# EAGLE schematic ES_Daisy_Field_Rev4 (EAGLE 9.6.2)

## Sheet 1 of 5
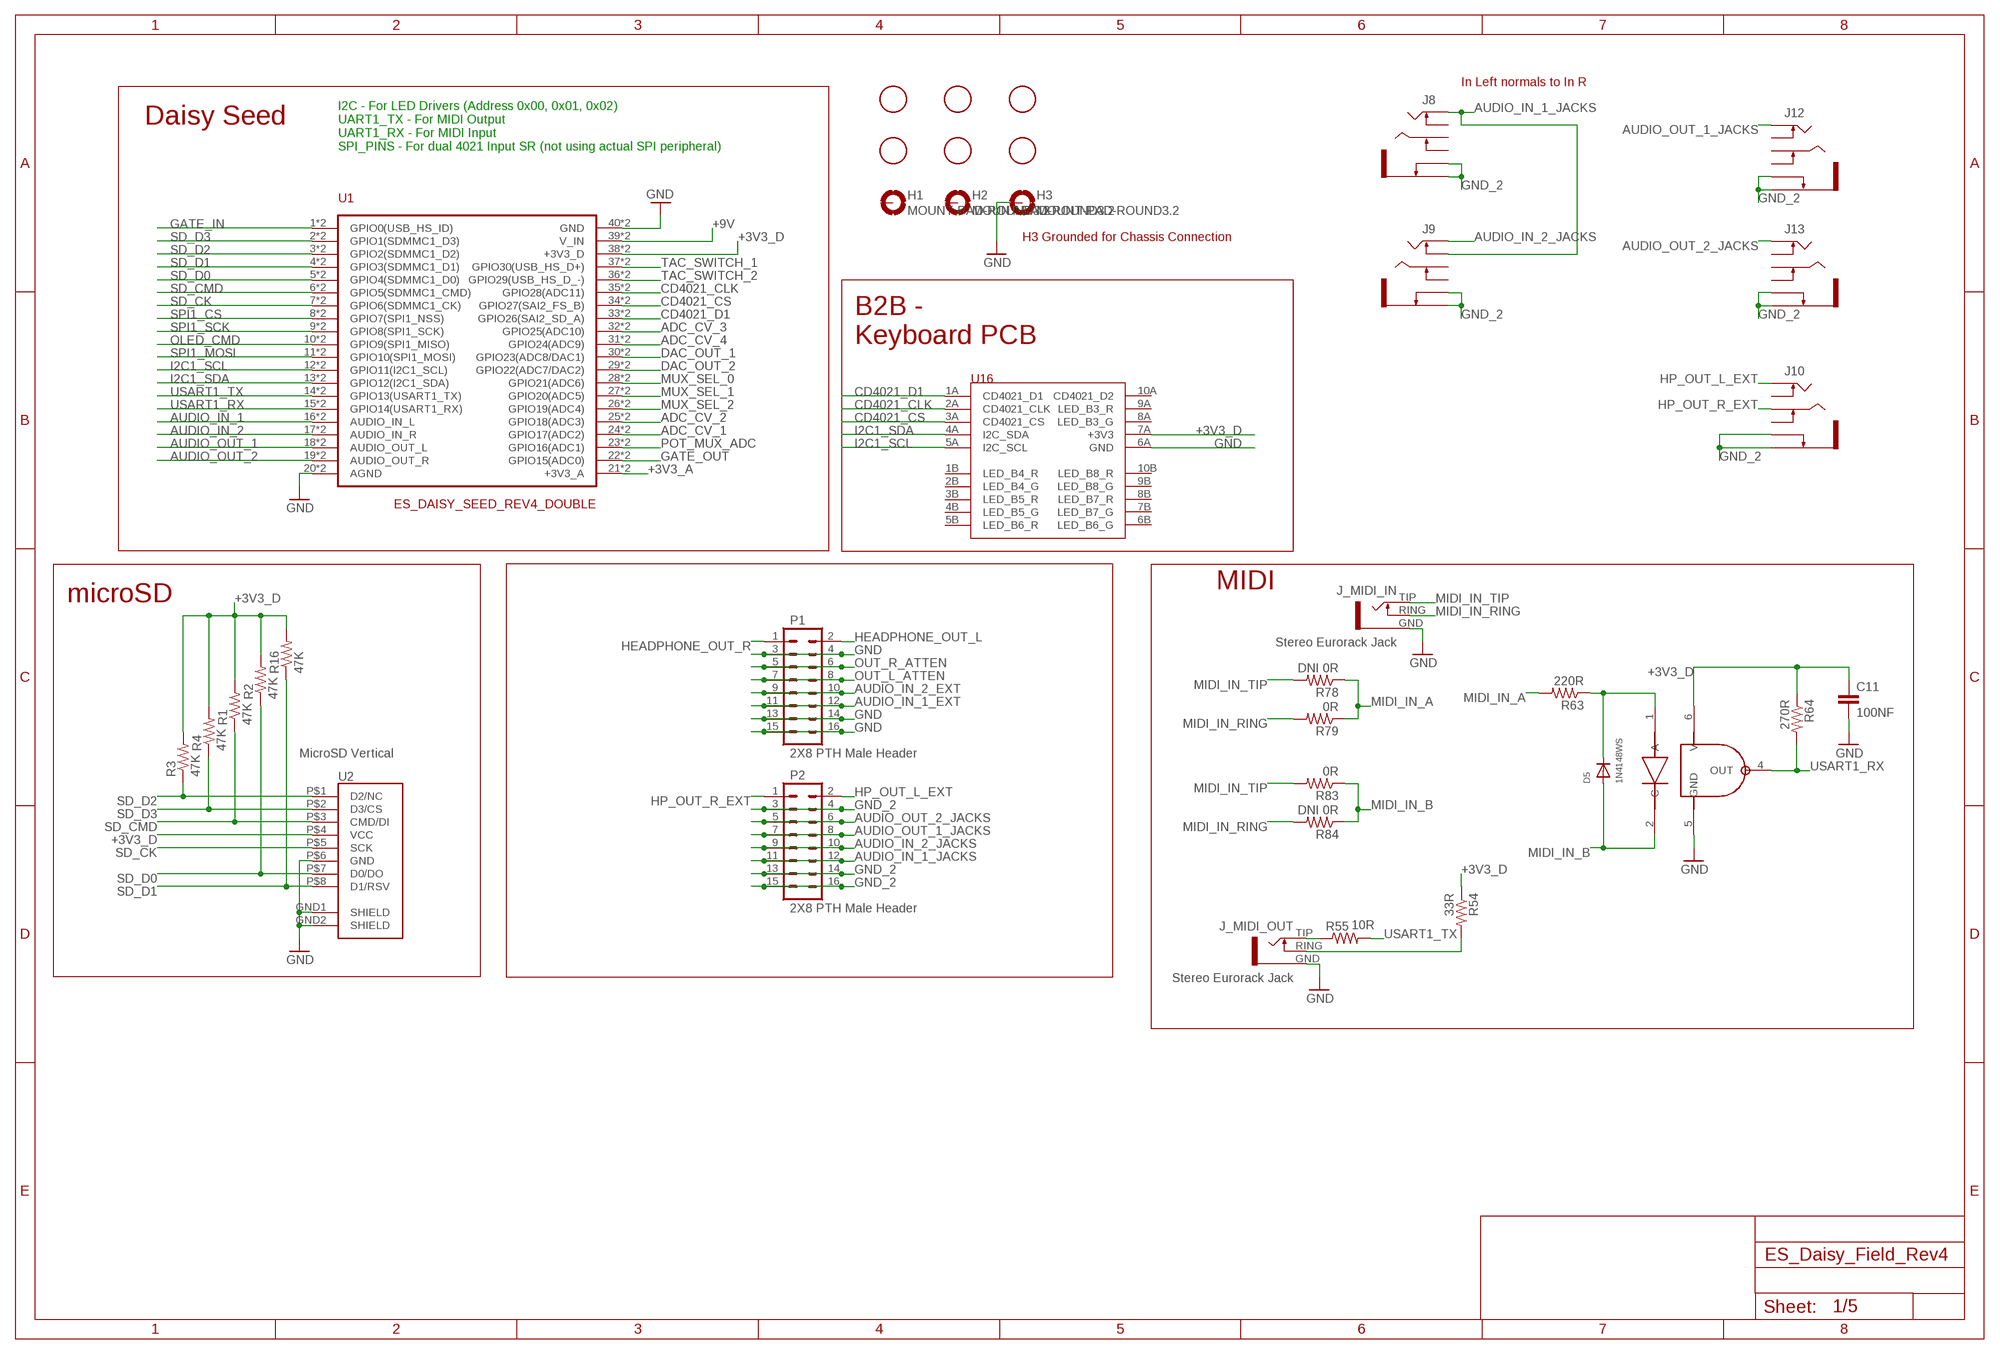
[diagram p0: schematic, sheet 1]

### Parts
C11  100NF  C-EUC0603  [C0603]
D5  1N4148WS  DIODE_SOD-323F  [SOD-323F]
FD1  FIDUCIAL  [FIDUCIAL_1MM]
FD2  FIDUCIAL  [FIDUCIAL_1MM]
FD3  FIDUCIAL  [FIDUCIAL_1MM]
FD4  FIDUCIAL  [FIDUCIAL_1MM]
FD5  FIDUCIAL  [FIDUCIAL_1MM]
FD6  FIDUCIAL  [FIDUCIAL_1MM]
H1  MOUNT-PAD-ROUND3.2  [32-PAD]
H2  MOUNT-PAD-ROUND3.2  [32-PAD]
H3  MOUNT-PAD-ROUND3.2  [32-PAD]
J8  PTH Switching Stereo Guitar Jack  JACK_TRS_SWITCHING_WQP-PJ6110  [WQP-PJ6110]
J9  PTH Switching Stereo Guitar Jack  JACK_TRS_SWITCHING_WQP-PJ6110  [WQP-PJ6110]
J10  PTH Switching Stereo Guitar Jack  JACK_TRS_SWITCHING_WQP-PJ6110  [WQP-PJ6110]
J12  PTH Switching Stereo Guitar Jack  JACK_TRS_SWITCHING_WQP-PJ6110  [WQP-PJ6110]
J13  PTH Switching Stereo Guitar Jack  JACK_TRS_SWITCHING_WQP-PJ6110  [WQP-PJ6110]
J_MIDI_IN  Stereo Eurorack Jack  STEREO_JACK  [STEREO_JACK_3.5MM]
J_MIDI_OUT  Stereo Eurorack Jack  STEREO_JACK  [STEREO_JACK_3.5MM]
P1  2X8 PTH Male Header  M08X2_LOCK_SILK  [2X8_LOCK]
P2  2X8 PTH Male Header  M08X2_LOCK_SILK  [2X8_LOCK]
R1  47K  R-US_R0603  [R0603]
R2  47K  R-US_R0603  [R0603]
R3  47K  R-US_R0603  [R0603]
R4  47K  R-US_R0603  [R0603]
R16  47K  R-US_R0603  [R0603]
R54  33R  R-US_R0603  [R0603]
R55  10R  R-US_R0603  [R0603]
R63  220R  R-US_R0603  [R0603]
R64  270R  R-US_R0603  [R0603]
R78  DNI 0R  R-US_R0603  [R0603]
R79  0R  R-US_R0603  [R0603]
R83  0R  R-US_R0603  [R0603]
R84  DNI 0R  R-US_R0603  [R0603]
U1  ES_DAISY_SEED_REV4_DOUBLE  [ES_DAISY_SEED_DOUBLE]
U2  MicroSD Vertical  MICRO_SD_CARDCENTERED  [VERT_MICROSD_CENTERED]
U15  OPTO ISOLATOR  OPTOISOLATOR_H11L1M  [DIL06_GULLWING]
U16  ES_KEYBOARD_SM_REV2_ALIGNED  [ES_KEYBOARD_SM_REV2_ALIGNED]

### Nets
+3V3_A: U1.21(+3V3_A) U1.B21(+3V3_A) ; also sheet 2
+3V3_D: C11.1 R1.2 R2.2 R3.2 R4.2 R16.2 R54.1 R64.1 U1.38(+3V3_D) U1.B38(+3V3_D) U2.P$4(VCC) U15.6(V) U16.7A(+3V3) ; also sheet 2,3
+9V: U1.39(V_IN) U1.B39(V_IN) ; also sheet 3,5
ADC_CV_1: U1.24(GPIO17(ADC2)) U1.B24(GPIO17(ADC2)) ; also sheet 2
ADC_CV_2: U1.25(GPIO18(ADC3)) U1.B25(GPIO18(ADC3)) ; also sheet 2
ADC_CV_3: U1.32(GPIO25(ADC10)) U1.B32(GPIO25(ADC10)) ; also sheet 2
ADC_CV_4: U1.31(GPIO24(ADC9)) U1.B31(GPIO24(ADC9)) ; also sheet 2
AUDIO_IN_1: U1.16(AUDIO_IN_L) U1.B16(AUDIO_IN_L) ; also sheet 4
AUDIO_IN_1_EXT: P1.11 P1.12 ; also sheet 4
AUDIO_IN_1_JACKS: J8.2(TIP) J9.5(TIP_SW) P2.11 P2.12
AUDIO_IN_2: U1.17(AUDIO_IN_R) U1.B17(AUDIO_IN_R) ; also sheet 4
AUDIO_IN_2_EXT: P1.9 P1.10 ; also sheet 4
AUDIO_IN_2_JACKS: J9.2(TIP) P2.9 P2.10
AUDIO_OUT_1: U1.18(AUDIO_OUT_L) U1.B18(AUDIO_OUT_L) ; also sheet 4
AUDIO_OUT_1_JACKS: J12.2(TIP) P2.7 P2.8
AUDIO_OUT_2: U1.19(AUDIO_OUT_R) U1.B19(AUDIO_OUT_R) ; also sheet 4
AUDIO_OUT_2_JACKS: J13.2(TIP) P2.5 P2.6
CD4021_CLK: U1.35(GPIO28(ADC11)) U1.B35(GPIO28(ADC11)) U16.2A(CD4021_CLK)
CD4021_CS: U1.34(GPIO27(SAI2_FS_B)) U1.B34(GPIO27(SAI2_FS_B)) U16.3A(CD4021_CS)
CD4021_D1: U1.33(GPIO26(SAI2_SD_A)) U1.B33(GPIO26(SAI2_SD_A)) U16.1A(CD4021_D1)
DAC_OUT_1: U1.30(GPIO23(ADC8/DAC1)) U1.B30(GPIO23(ADC8/DAC1)) ; also sheet 2
DAC_OUT_2: U1.29(GPIO22(ADC7/DAC2)) U1.B29(GPIO22(ADC7/DAC2)) ; also sheet 2
GATE_IN: U1.1(GPIO0(USB_HS_ID)) U1.B1(GPIO0(USB_HS_ID)) ; also sheet 2
GATE_OUT: U1.22(GPIO15(ADC0)) U1.B22(GPIO15(ADC0)) ; also sheet 2
GND: C11.2 H3.B3,2(MOUNT) J_MIDI_IN.GND J_MIDI_OUT.GND P1.3 P1.4 P1.13 P1.14 P1.15 P1.16 U1.20(AGND) U1.40(GND) U1.B20(AGND) U1.B40(GND) U2.GND1(SHIELD) U2.GND2(SHIELD) U2.P$6(GND) U15.5(GND) U16.6A(GND) ; also sheet 2,3,4,5
GND_2: J8.1(SLEEVE) J8.4(SLEEVE_SW) J9.1(SLEEVE) J9.4(SLEEVE_SW) J10.1(SLEEVE) J10.4(SLEEVE_SW) J12.1(SLEEVE) J12.4(SLEEVE_SW) J13.1(SLEEVE) J13.4(SLEEVE_SW) P2.3 P2.4 P2.13 P2.14 P2.15 P2.16
HEADPHONE_OUT_L [DATA]: P1.2 ; also sheet 4
HEADPHONE_OUT_R [DATA]: P1.1 ; also sheet 4
HP_OUT_L_EXT: J10.2(TIP) P2.2
HP_OUT_R_EXT: J10.3(RING) P2.1
I2C1_SCL: U1.12(GPIO11(I2C1_SCL)) U1.B12(GPIO11(I2C1_SCL)) U16.5A(I2C_SCL) ; also sheet 3
I2C1_SDA: U1.13(GPIO12(I2C1_SDA)) U1.B13(GPIO12(I2C1_SDA)) U16.4A(I2C_SDA) ; also sheet 3
MIDI_IN_A: R63.2 R78.1 R79.1
MIDI_IN_B: D5.A R83.1 R84.1 U15.2(C)
MIDI_IN_RING: J_MIDI_IN.RING(NORM) R79.2 R84.2
MIDI_IN_TIP: J_MIDI_IN.TIP R78.2 R83.2
MUX_SEL_0: U1.28(GPIO21(ADC6)) U1.B28(GPIO21(ADC6)) ; also sheet 2
MUX_SEL_1: U1.27(GPIO20(ADC5)) U1.B27(GPIO20(ADC5)) ; also sheet 2
MUX_SEL_2: U1.26(GPIO19(ADC4)) U1.B26(GPIO19(ADC4)) ; also sheet 2
N$51: J_MIDI_OUT.TIP R55.1
N$52: J_MIDI_OUT.RING(NORM) R54.2
N$77: D5.C R63.1 U15.1(A)
OLED_CMD: U1.10(GPIO9(SPI1_MISO)) U1.B10(GPIO9(SPI1_MISO)) ; also sheet 3
OUT_L_ATTEN: P1.7 P1.8 ; also sheet 4
OUT_R_ATTEN: P1.5 P1.6 ; also sheet 4
POT_MUX_ADC: U1.23(GPIO16(ADC1)) U1.B23(GPIO16(ADC1)) ; also sheet 2
SD_CK: U1.7(GPIO6(SDMMC1_CK)) U1.B7(GPIO6(SDMMC1_CK)) U2.P$5(SCK)
SD_CMD: R1.1 U1.6(GPIO5(SDMMC1_CMD)) U1.B6(GPIO5(SDMMC1_CMD)) U2.P$3(CMD/DI)
SD_D0: R2.1 U1.5(GPIO4(SDMMC1_D0)) U1.B5(GPIO4(SDMMC1_D0)) U2.P$7(D0/DO)
SD_D1: R16.1 U1.4(GPIO3(SDMMC1_D1)) U1.B4(GPIO3(SDMMC1_D1)) U2.P$8(D1/RSV)
SD_D2: R3.1 U1.3(GPIO2(SDMMC1_D2)) U1.B3(GPIO2(SDMMC1_D2)) U2.P$1(D2/NC)
SD_D3: R4.1 U1.2(GPIO1(SDMMC1_D3)) U1.B2(GPIO1(SDMMC1_D3)) U2.P$2(D3/CS)
SPI1_CS: U1.8(GPIO7(SPI1_NSS)) U1.B8(GPIO7(SPI1_NSS)) ; also sheet 3
SPI1_MOSI: U1.11(GPIO10(SPI1_MOSI)) U1.B11(GPIO10(SPI1_MOSI)) ; also sheet 3
SPI1_SCK: U1.9(GPIO8(SPI1_SCK)) U1.B9(GPIO8(SPI1_SCK)) ; also sheet 3
TAC_SWITCH_1: U1.37(GPIO30(USB_HS_D+)) U1.B37(GPIO30(USB_HS_D+)) ; also sheet 2
TAC_SWITCH_2: U1.36(GPIO29(USB_HS_D_-)) U1.B36(GPIO29(USB_HS_D_-)) ; also sheet 2
USART1_RX: R64.2 U1.15(GPIO14(USART1_RX)) U1.B15(GPIO14(USART1_RX)) U15.4(OUT)
USART1_TX: R55.2 U1.14(GPIO13(USART1_TX)) U1.B14(GPIO13(USART1_TX))
Unconnected: H1.B3,2(MOUNT) H2.B3,2(MOUNT) J8.3(RING) J8.5(TIP_SW) J8.6(RING_SW) J9.3(RING) J9.6(RING_SW) J10.5(TIP_SW) J10.6(RING_SW) J12.3(RING) J12.5(TIP_SW) J12.6(RING_SW) J13.3(RING) J13.5(TIP_SW) J13.6(RING_SW) U16.1B(LED_B4_R) U16.2B(LED_B4_G) U16.3B(LED_B5_R) U16.4B(LED_B5_G) U16.5B(LED_B6_R) U16.6B(LED_B6_G) U16.7B(LED_B7_G) U16.8A(LED_B3_G) U16.8B(LED_B7_R) U16.9A(LED_B3_R) U16.9B(LED_B8_G) U16.10A(CD4021_D2) U16.10B(LED_B8_R)

### Notes on the sheet
- In Left normals to In R
- Daisy Seed
- I2C - For LED Drivers (Address 0x00, 0x01, 0x02)
  UART1_TX - For MIDI Output
  UART1_RX - For MIDI Input
  SPI_PINS - For dual 4021 Input SR (not using actual SPI peripheral)
- H3 Grounded for Chassis Connection
- B2B - 
  Keyboard PCB
- MIDI
- microSD

## Sheet 2 of 5
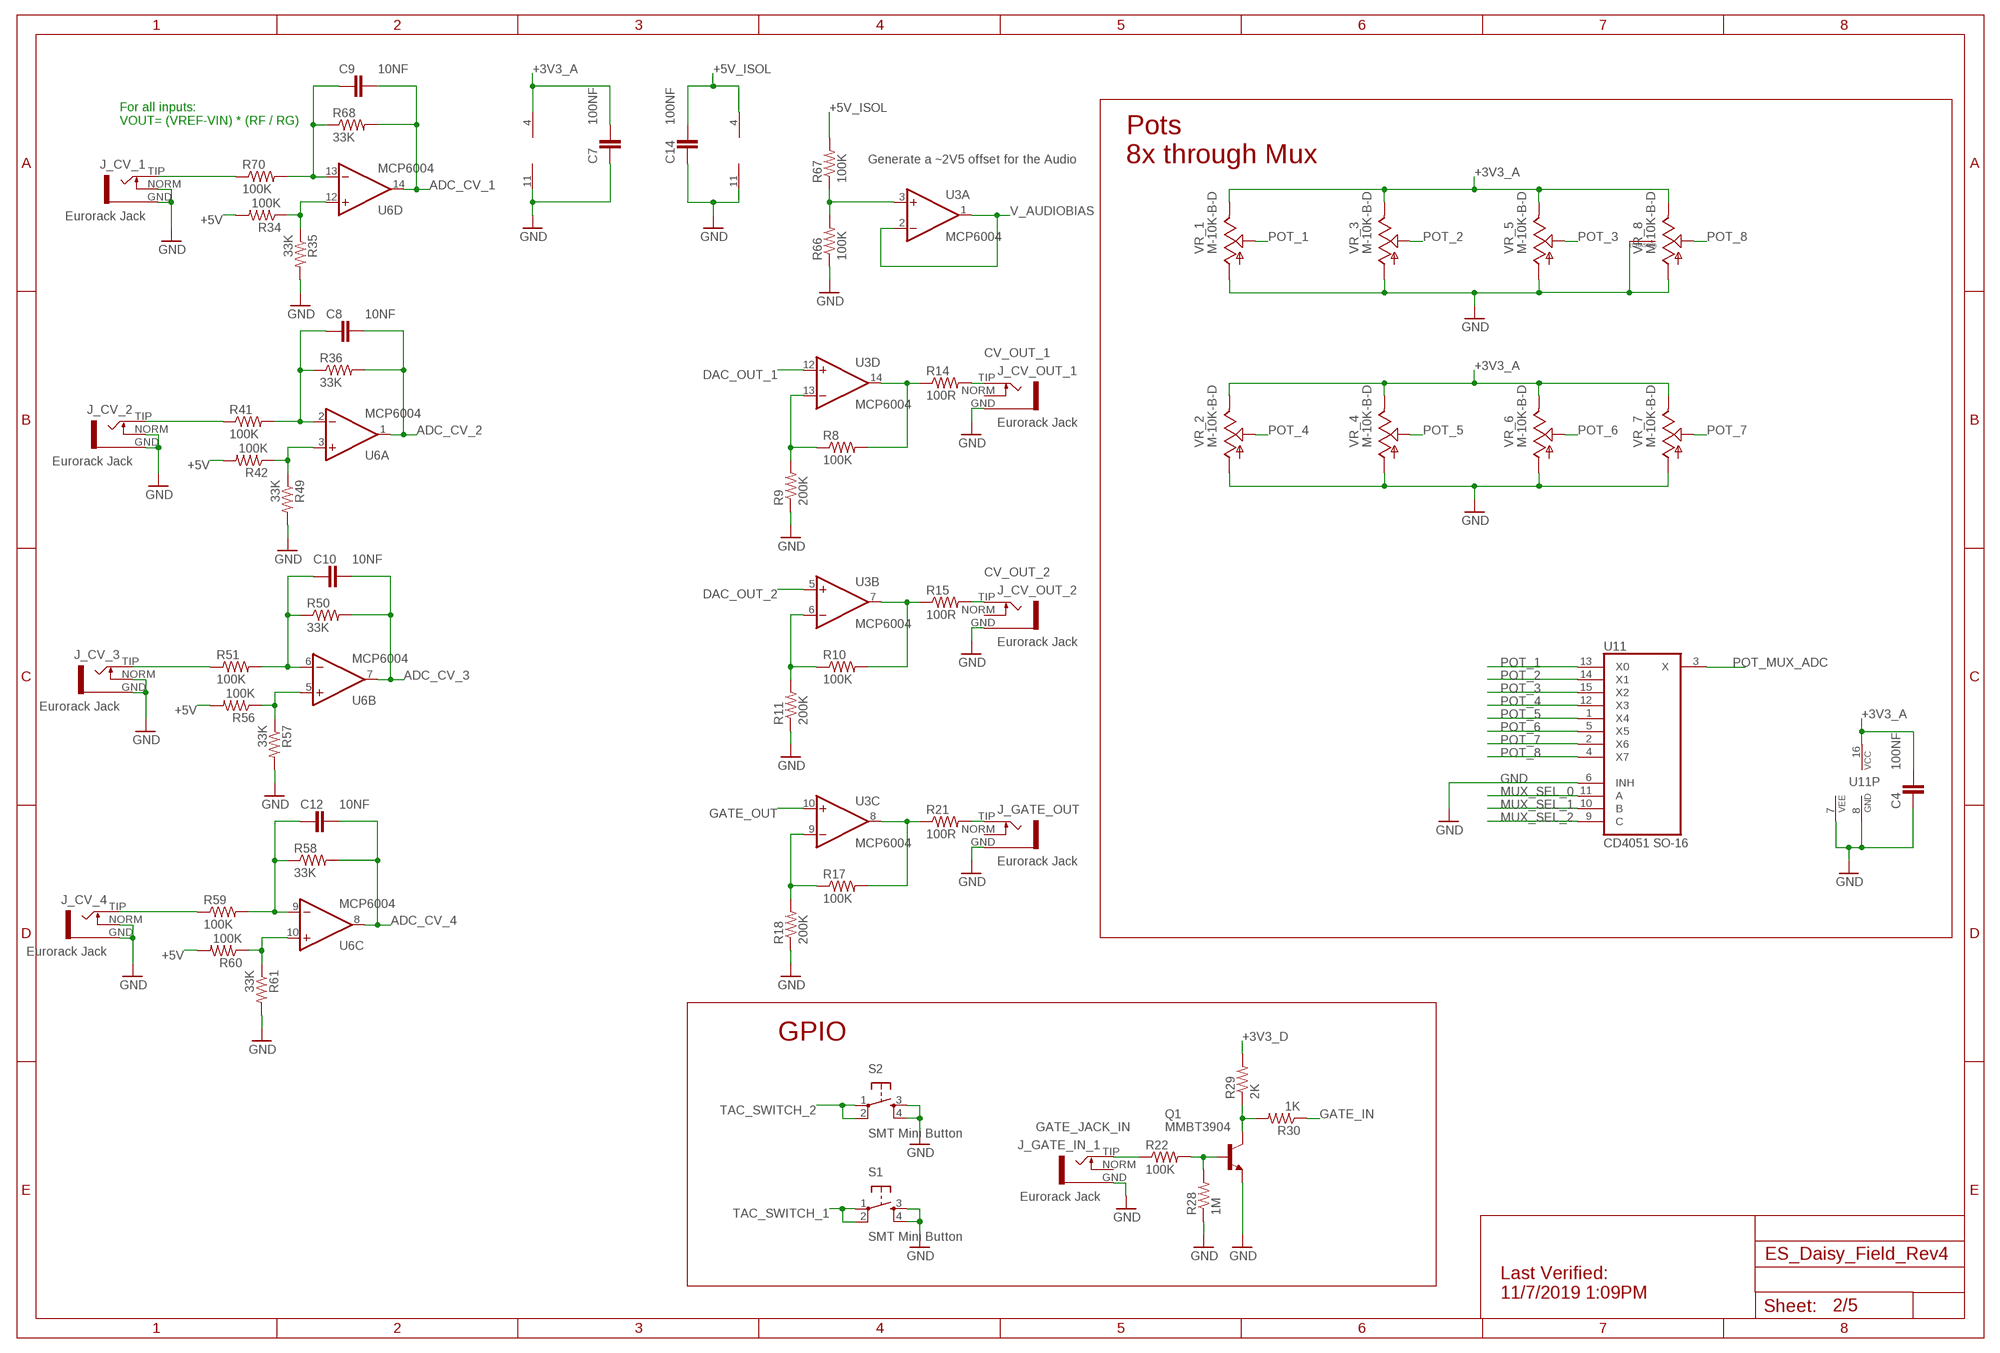
[diagram p1: schematic, sheet 2]

### Parts
C4  100NF  C-EUC0603  [C0603]
C7  100NF  C-EUC0603  [C0603]
C8  10NF  C-EUC0603  [C0603]
C9  10NF  C-EUC0603  [C0603]
C10  10NF  C-EUC0603  [C0603]
C12  10NF  C-EUC0603  [C0603]
C14  100NF  C-EUC0603  [C0603]
J_CV_1  Eurorack Jack  EURO_JACK  [S_JACK]
J_CV_2  Eurorack Jack  EURO_JACK  [S_JACK]
J_CV_3  Eurorack Jack  EURO_JACK  [S_JACK]
J_CV_4  Eurorack Jack  EURO_JACK  [S_JACK]
J_CV_OUT_1  Eurorack Jack  EURO_JACK  [S_JACK]
J_CV_OUT_2  Eurorack Jack  EURO_JACK  [S_JACK]
J_GATE_IN_1  Eurorack Jack  EURO_JACK  [S_JACK]
J_GATE_OUT  Eurorack Jack  EURO_JACK  [S_JACK]
Q1  MMBT3904  NPNSOT23-BEC  [SOT23-BEC]
R8  100K  R-US_R0603  [R0603]
R9  200K  R-US_R0603  [R0603]
R10  100K  R-US_R0603  [R0603]
R11  200K  R-US_R0603  [R0603]
R14  100R  R-US_R0603  [R0603]
R15  100R  R-US_R0603  [R0603]
R17  100K  R-US_R0603  [R0603]
R18  200K  R-US_R0603  [R0603]
R21  100R  R-US_R0603  [R0603]
R22  100K  R-US_R0603  [R0603]
R28  1M  R-US_R0603  [R0603]
R29  2K  R-US_R0603  [R0603]
R30  1K  R-US_R0603  [R0603]
R34  100K  R-US_R0603  [R0603]
R35  33K  R-US_R0603  [R0603]
R36  33K  R-US_R0603  [R0603]
R41  100K  R-US_R0603  [R0603]
R42  100K  R-US_R0603  [R0603]
R49  33K  R-US_R0603  [R0603]
R50  33K  R-US_R0603  [R0603]
R51  100K  R-US_R0603  [R0603]
R56  100K  R-US_R0603  [R0603]
R57  33K  R-US_R0603  [R0603]
R58  33K  R-US_R0603  [R0603]
R59  100K  R-US_R0603  [R0603]
R60  100K  R-US_R0603  [R0603]
R61  33K  R-US_R0603  [R0603]
R66  100K  R-US_R0603  [R0603]
R67  100K  R-US_R0603  [R0603]
R68  33K  R-US_R0603  [R0603]
R70  100K  R-US_R0603  [R0603]
S1  SMT Mini Button  TAC_SWITCH_SMT  [TL3301SPF160QJ]
S2  SMT Mini Button  TAC_SWITCH_SMT  [TL3301SPF160QJ]
U3  MCP6004  MCP6004_TSSOP-14  [TSSOP-14]
U6  MCP6004  MCP6004_TSSOP-14  [TSSOP-14]
U11  CD4051 SO-16  4051D  [SO-16]
VR_1  M-10K-B-D  POT_9MM_SNAP-IN__  [9MM_SNAP-IN_POT_SILK]
VR_2  M-10K-B-D  POT_9MM_SNAP-IN__  [9MM_SNAP-IN_POT_SILK]
VR_3  M-10K-B-D  POT_9MM_SNAP-IN__  [9MM_SNAP-IN_POT_SILK]
VR_4  M-10K-B-D  POT_9MM_SNAP-IN__  [9MM_SNAP-IN_POT_SILK]
VR_5  M-10K-B-D  POT_9MM_SNAP-IN__  [9MM_SNAP-IN_POT_SILK]
VR_6  M-10K-B-D  POT_9MM_SNAP-IN__  [9MM_SNAP-IN_POT_SILK]
VR_7  M-10K-B-D  POT_9MM_SNAP-IN__  [9MM_SNAP-IN_POT_SILK]
VR_8  M-10K-B-D  POT_9MM_CHASSIS_  [9MM_SNAP-IN_POT_SILK]

### Nets
+3V3_A: C4.2 C7.2 U6.4(P:V+) U11.16(VCC) VR_1.3 VR_2.3 VR_3.3 VR_4.3 VR_5.3 VR_6.3 VR_7.3 VR_8.3(E) ; also sheet 1
+3V3_D: R29.2 ; also sheet 1,3
+5V: R34.2 R42.2 R56.2 R60.2 ; also sheet 5
+5V_ISOL: C14.2 R67.2 U3.4(P:V+) ; also sheet 4,5
ADC_CV_1: C9.2 R68.2 U6.14(D:OUT) ; also sheet 1
ADC_CV_2: C8.2 R36.2 U6.1(A:OUT) ; also sheet 1
ADC_CV_3: C10.2 R50.2 U6.7(B:OUT) ; also sheet 1
ADC_CV_4: C12.2 R58.2 U6.8(C:OUT) ; also sheet 1
CV_OUT_1: J_CV_OUT_1.TIP R14.2
CV_OUT_2: J_CV_OUT_2.TIP R15.2
CV_OUT_3: J_GATE_OUT.TIP R21.2
DAC_OUT_1: U3.12(D:+IN) ; also sheet 1
DAC_OUT_2: U3.5(B:+IN) ; also sheet 1
GATE_IN: R30.1 ; also sheet 1
GATE_JACK_IN: J_GATE_IN_1.TIP R22.1
GATE_OUT: U3.10(C:+IN) ; also sheet 1
GND: C4.1 C7.1 C14.1 J_CV_1.GND J_CV_1.NORM J_CV_2.GND J_CV_2.NORM J_CV_3.GND J_CV_3.NORM J_CV_4.GND J_CV_4.NORM J_CV_OUT_1.GND J_CV_OUT_2.GND J_GATE_IN_1.GND J_GATE_OUT.GND Q1.E R9.1 R11.1 R18.1 R28.1 R35.2 R49.2 R57.2 R61.2 R66.1 S1.3 S1.4 S2.3 S2.4 U3.11(P:V-) U6.11(P:V-) U11.6(INH) U11.7(VEE) U11.8(GND) VR_1.1 VR_2.1 VR_3.1 VR_4.1 VR_5.1 VR_6.1 VR_7.1 VR_8.1(A) VR_8.CHASSIS1(CHASSIS) VR_8.CHASSIS2(CHASSIS) ; also sheet 1,3,4,5
MUX_SEL_0: U11.11(A) ; also sheet 1
MUX_SEL_1: U11.10(B) ; also sheet 1
MUX_SEL_2: U11.9(C) ; also sheet 1
N$3: R10.2 R15.1 U3.7(B:OUT)
N$4: R8.2 R14.1 U3.14(D:OUT)
N$5: R8.1 R9.2 U3.13(D:-IN)
N$6: R34.1 R35.1 U6.12(D:+IN)
N$7: R10.1 R11.2 U3.6(B:-IN)
N$8: C8.1 R36.1 R41.2 U6.2(A:-IN)
N$9: Q1.C R29.1 R30.2
N$10: J_CV_2.TIP R41.1
N$11: R42.1 R49.1 U6.3(A:+IN)
N$13: R17.2 R21.1 U3.8(C:OUT)
N$14: R17.1 R18.2 U3.9(C:-IN)
N$21: C10.1 R50.1 R51.2 U6.6(B:-IN)
N$22: J_CV_3.TIP R51.1
N$25: R56.1 R57.1 U6.5(B:+IN)
N$26: C12.1 R58.1 R59.2 U6.9(C:-IN)
N$27: J_CV_4.TIP R59.1
N$28: R60.1 R61.1 U6.10(C:+IN)
N$32: Q1.B R22.2 R28.2
N$42: R66.2 R67.1 U3.3(A:+IN)
N$108: C9.1 R68.1 R70.2 U6.13(D:-IN)
N$110: J_CV_1.TIP R70.1
POT_1: U11.13(X0) VR_1.2
POT_2: U11.14(X1) VR_3.2
POT_3: U11.15(X2) VR_5.2
POT_4: U11.12(X3) VR_2.2
POT_5: U11.1(X4) VR_4.2
POT_6: U11.5(X5) VR_6.2
POT_7: U11.2(X6) VR_7.2
POT_8: U11.4(X7) VR_8.2(S)
POT_MUX_ADC: U11.3(X) ; also sheet 1
TAC_SWITCH_1: S1.1 S1.2 ; also sheet 1
TAC_SWITCH_2: S2.1 S2.2 ; also sheet 1
V_AUDIOBIAS: U3.1(A:OUT) U3.2(A:-IN) ; also sheet 4
Unconnected: J_CV_OUT_1.NORM J_CV_OUT_2.NORM J_GATE_IN_1.NORM J_GATE_OUT.NORM

### Notes on the sheet
- For all inputs:
  VOUT= (VREF-VIN) * (RF / RG)
- Generate a ~2V5 offset for the Audio
- Pots
  8x through Mux
- GPIO
- Last Verified:
  11/7/2019 1:09PM

## Sheet 3 of 5
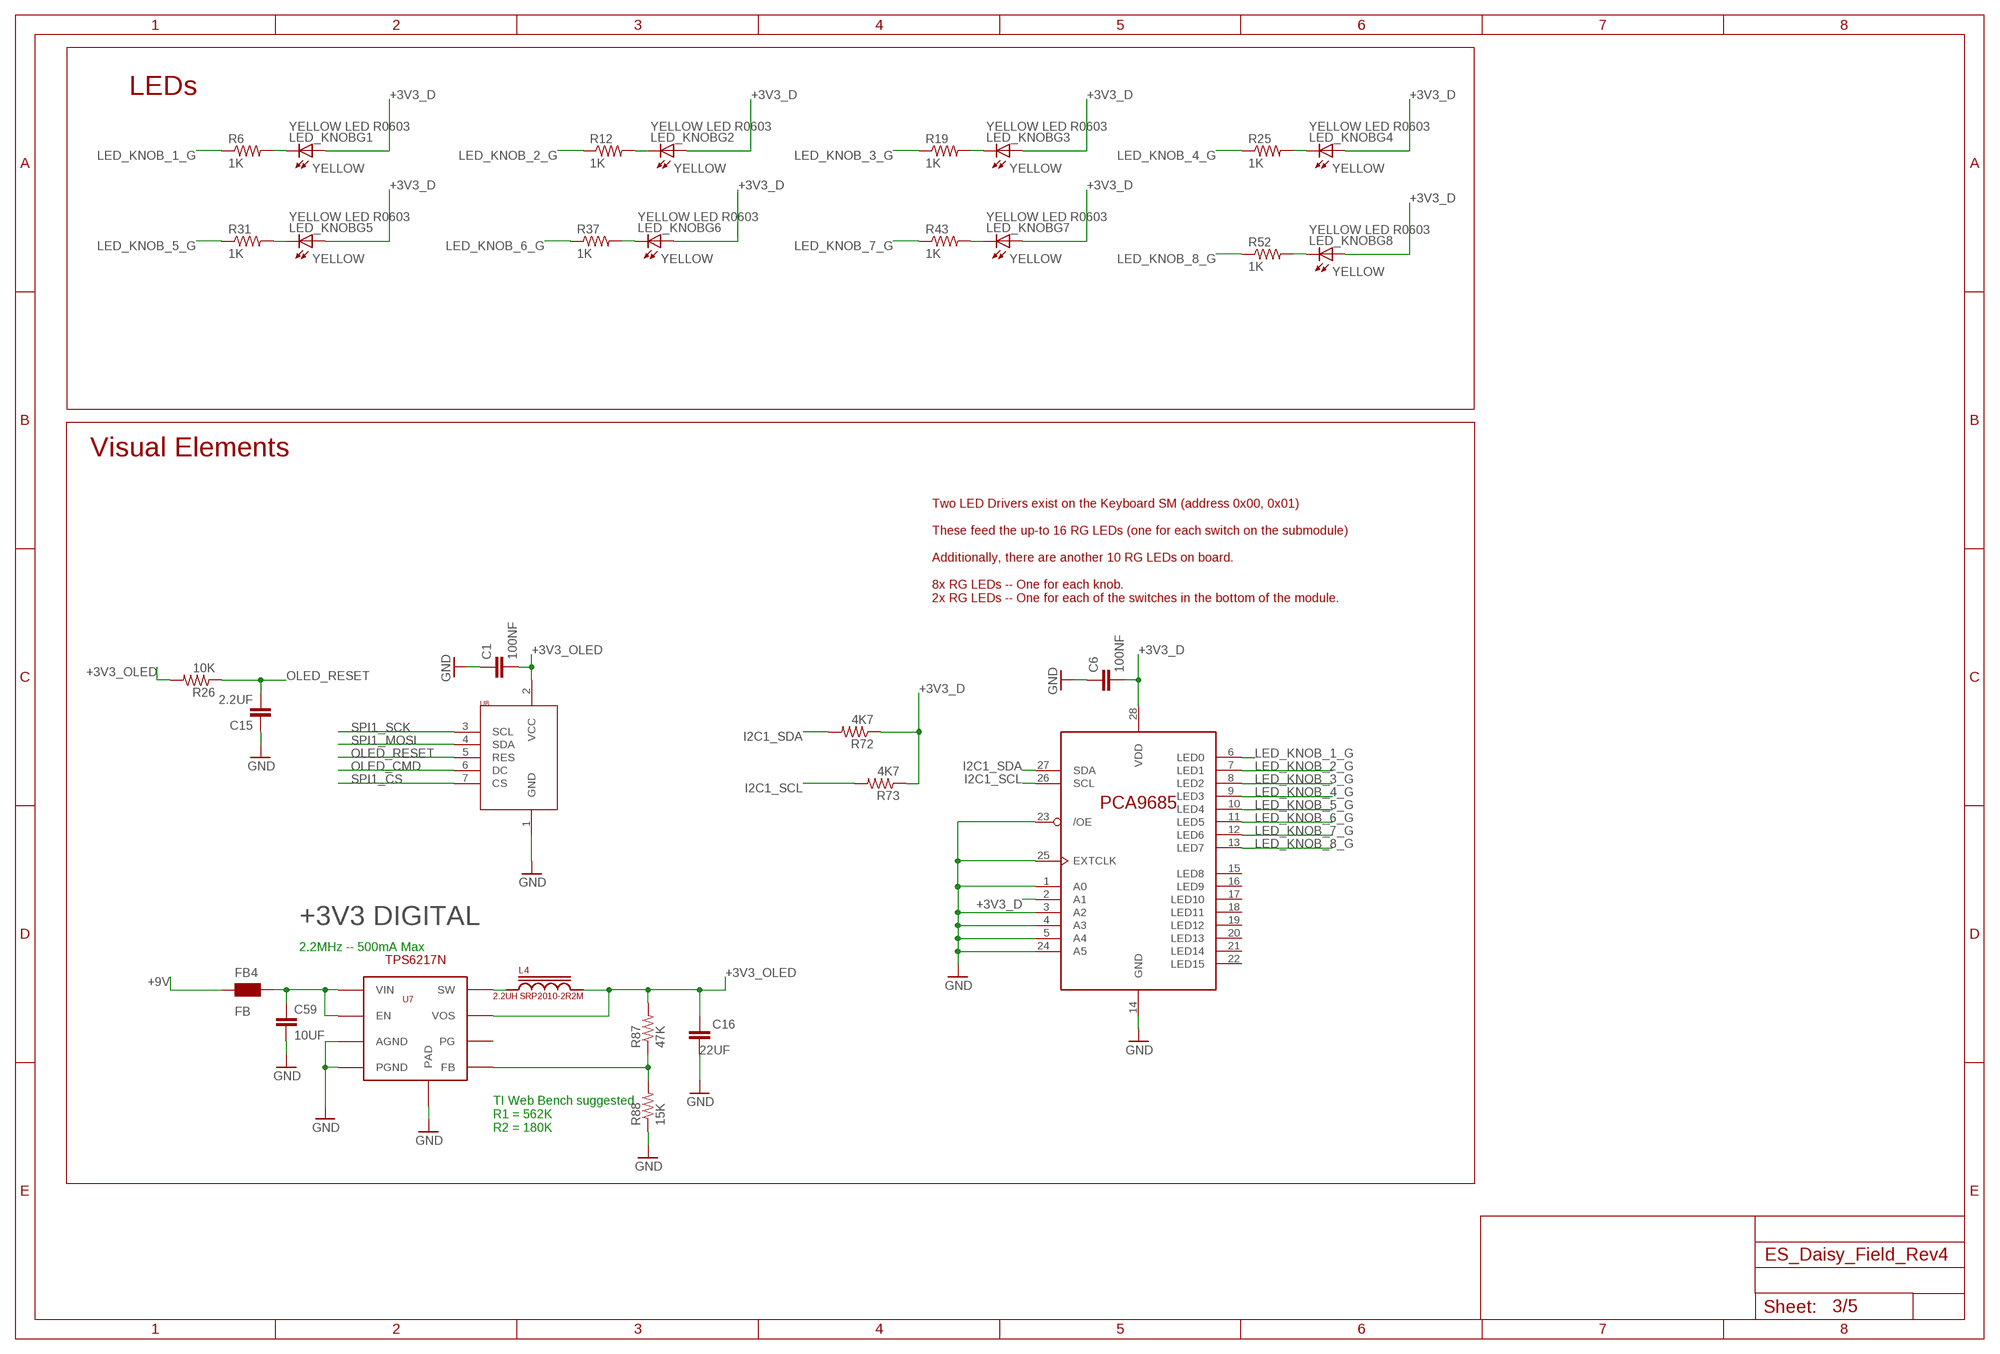
[diagram p2: schematic, sheet 3]

### Parts
C1  100NF  C-EUC0603  [C0603]
C6  100NF  C-EUC0603  [C0603]
C15  2.2UF  C-EUC0603  [C0603]
C16  22UF  C-EUC1206  [C1206]
C59  10UF  C-EUC0805  [C0805]
FB4  FB  FERRITE_BEAD_0603  [WUERTH-ELEKTRONIK_0603]
L4  2.2UH SRP2010-2R2M  INDUCTORS  [BOURNS_SRP2010]
LED_KNOBG1  YELLOW LED R0603  LED_YELLOW_0603  [DIODE_0603]
LED_KNOBG2  YELLOW LED R0603  LED_YELLOW_0603  [DIODE_0603]
LED_KNOBG3  YELLOW LED R0603  LED_YELLOW_0603  [DIODE_0603]
LED_KNOBG4  YELLOW LED R0603  LED_YELLOW_0603  [DIODE_0603]
LED_KNOBG5  YELLOW LED R0603  LED_YELLOW_0603  [DIODE_0603]
LED_KNOBG6  YELLOW LED R0603  LED_YELLOW_0603  [DIODE_0603]
LED_KNOBG7  YELLOW LED R0603  LED_YELLOW_0603  [DIODE_0603]
LED_KNOBG8  YELLOW LED R0603  LED_YELLOW_0603  [DIODE_0603]
R6  1K  R-US_R0603  [R0603]
R12  1K  R-US_R0603  [R0603]
R19  1K  R-US_R0603  [R0603]
R25  1K  R-US_R0603  [R0603]
R26  10K  R-US_R0603  [R0603]
R31  1K  R-US_R0603  [R0603]
R37  1K  R-US_R0603  [R0603]
R43  1K  R-US_R0603  [R0603]
R52  1K  R-US_R0603  [R0603]
R72  4K7  R-US_R0603  [R0603]
R73  4K7  R-US_R0603  [R0603]
R87  47K  R-US_R0603  [R0603]
R88  15K  R-US_R0603  [R0603]
U5  PCA9685 TSSOP-28  PCA9685PW  [TSSOP-28]
U7  TPS62170 WSON-8  TPS6217N  [WSON-8]
U8  OLED_DISPLAY  [ER-OLEDM015-2]

### Nets
+3V3_D: C6.2 LED_KNOBG1.ANODE(A) LED_KNOBG2.ANODE(A) LED_KNOBG3.ANODE(A) LED_KNOBG4.ANODE(A) LED_KNOBG5.ANODE(A) LED_KNOBG6.ANODE(A) LED_KNOBG7.ANODE(A) LED_KNOBG8.ANODE(A) R72.1 R73.1 U5.2(A1) U5.28(VDD) ; also sheet 1,2
+3V3_OLED: C1.2 C16.1 L4.P$2 R26.2 R87.2 U7.6(VOS) U8.2(VCC)
+9V: FB4.1 ; also sheet 1,5
GND: C1.1 C6.1 C15.1 C16.2 C59.2 R88.1 U5.1(A0) U5.3(A2) U5.4(A3) U5.5(A4) U5.14(GND) U5.23(/OE) U5.24(A5) U5.25(EXTCLK) U7.1(PGND) U7.4(AGND) U7.P$1(PAD) U7.P$9(PAD) U8.1(GND) ; also sheet 1,2,4,5
I2C1_SCL: R73.2 U5.26(SCL) ; also sheet 1
I2C1_SDA: R72.2 U5.27(SDA) ; also sheet 1
LED_KNOB_1_G: R6.1 U5.6(LED0)
LED_KNOB_2_G: R12.1 U5.7(LED1)
LED_KNOB_3_G: R19.1 U5.8(LED2)
LED_KNOB_4_G: R25.1 U5.9(LED3)
LED_KNOB_5_G: R31.1 U5.10(LED4)
LED_KNOB_6_G: R37.1 U5.11(LED5)
LED_KNOB_7_G: R43.1 U5.12(LED6)
LED_KNOB_8_G: R52.1 U5.13(LED7)
N$1: LED_KNOBG1.CATHODE(C) R6.2
N$16: LED_KNOBG2.CATHODE(C) R12.2
N$17: LED_KNOBG3.CATHODE(C) R19.2
N$23: LED_KNOBG4.CATHODE(C) R25.2
N$29: LED_KNOBG5.CATHODE(C) R31.2
N$35: LED_KNOBG6.CATHODE(C) R37.2
N$46: LED_KNOBG7.CATHODE(C) R43.2
N$47: LED_KNOBG8.CATHODE(C) R52.2
N$54: C59.1 FB4.2 U7.2(VIN) U7.3(EN)
N$55: R87.1 R88.2 U7.5(FB)
N$57: L4.P$1 U7.7(SW)
OLED_CMD: U8.6(DC) ; also sheet 1
OLED_RESET: C15.2 R26.1 U8.5(RES)
SPI1_CS: U8.7(CS) ; also sheet 1
SPI1_MOSI: U8.4(SDA) ; also sheet 1
SPI1_SCK: U8.3(SCL) ; also sheet 1
Unconnected: U5.15(LED8) U5.16(LED9) U5.17(LED10) U5.18(LED11) U5.19(LED12) U5.20(LED13) U5.21(LED14) U5.22(LED15) U7.8(PG)

### Notes on the sheet
- LEDs
- Visual Elements
- Two LED Drivers exist on the Keyboard SM (address 0x00, 0x01)
  
  These feed the up-to 16 RG LEDs (one for each switch on the submodule)
  
  Additionally, there are another 10 RG LEDs on board.
  
  8x RG LEDs -- One for each knob.
  2x RG LEDs -- One for each of the switches in the bottom of the module.
- +3V3 DIGITAL
- 2.2MHz -- 500mA Max
- TI Web Bench suggested
  R1 = 562K
  R2 = 180K

## Sheet 4 of 5
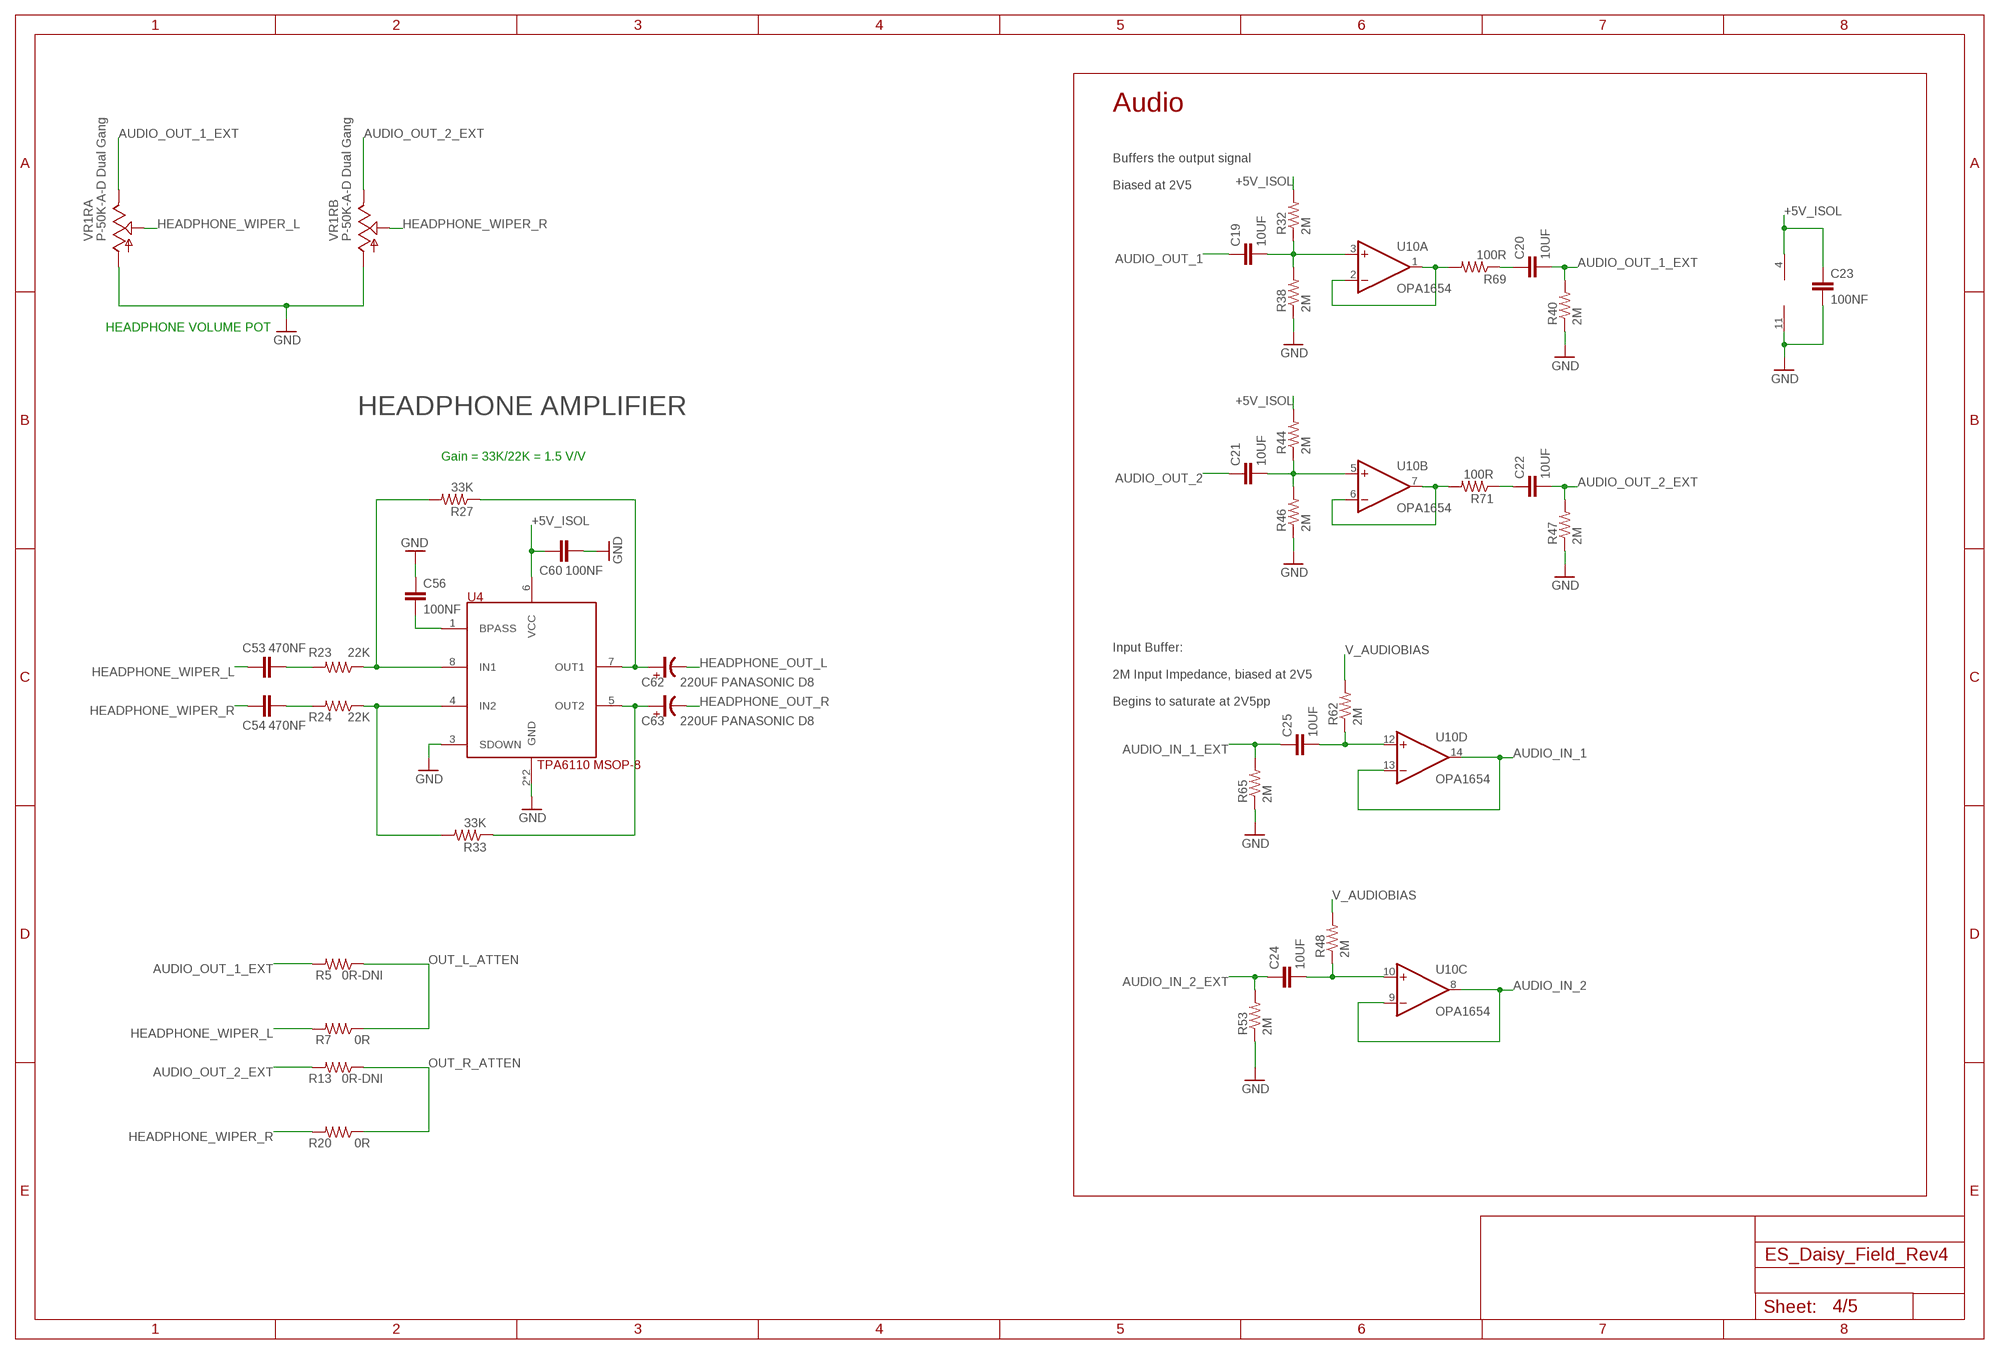
[diagram p3: schematic, sheet 4]

### Parts
C19  10UF  C-EUC0805  [C0805]
C20  10UF  C-EUC0805  [C0805]
C21  10UF  C-EUC0805  [C0805]
C22  10UF  C-EUC0805  [C0805]
C23  100NF  C-EUC0603  [C0603]
C24  10UF  C-EUC0805  [C0805]
C25  10UF  C-EUC0805  [C0805]
C53  470NF  C-EUC0603  [C0603]
C54  470NF  C-EUC0603  [C0603]
C56  100NF  C-EUC0603  [C0603]
C60  100NF  C-EUC0603  [C0603]
C62  220UF PANASONIC D8  C-EU-POL_D  [PANASONIC_D]
C63  220UF PANASONIC D8  C-EU-POL_D  [PANASONIC_D]
R5  0R-DNI  R-US_R0603  [R0603]
R7  0R  R-US_R0603  [R0603]
R13  0R-DNI  R-US_R0603  [R0603]
R20  0R  R-US_R0603  [R0603]
R23  22K  R-US_R0603  [R0603]
R24  22K  R-US_R0603  [R0603]
R27  33K  R-US_R0603  [R0603]
R32  2M  R-US_R0603  [R0603]
R33  33K  R-US_R0603  [R0603]
R38  2M  R-US_R0603  [R0603]
R40  2M  R-US_R0603  [R0603]
R44  2M  R-US_R0603  [R0603]
R46  2M  R-US_R0603  [R0603]
R47  2M  R-US_R0603  [R0603]
R48  2M  R-US_R0603  [R0603]
R53  2M  R-US_R0603  [R0603]
R62  2M  R-US_R0603  [R0603]
R65  2M  R-US_R0603  [R0603]
R69  100R  R-US_R0603  [R0603]
R71  100R  R-US_R0603  [R0603]
U4  TPA6110 MSOP-8  TPA6110MSOP  [MSOP_8_PWRPAD]
U10  OPA1654  OPA1654_TSSOP-14  [TSSOP-14]
VR1  P-50K-A-D Dual Gang  POT_DUAL_GANG  [BOURNS_PTV112_SILK]

### Nets
+5V_ISOL: C23.1 C60.2 R32.2 R44.2 U4.6(VCC) U10.4(P:V+) ; also sheet 2,5
AUDIO_IN_1: U10.13(D:-IN) U10.14(D:OUT) ; also sheet 1
AUDIO_IN_1_EXT: C25.1 R65.2 ; also sheet 1
AUDIO_IN_2: U10.8(C:OUT) U10.9(C:-IN) ; also sheet 1
AUDIO_IN_2_EXT: C24.1 R53.2 ; also sheet 1
AUDIO_OUT_1: C19.1 ; also sheet 1
AUDIO_OUT_1_EXT: C20.2 R5.2 R40.2 VR1.3P
AUDIO_OUT_2: C21.1 ; also sheet 1
AUDIO_OUT_2_EXT: C22.2 R13.2 R47.2 VR1.3
GND: C23.2 C56.1 C60.1 R38.1 R40.1 R46.1 R47.1 R53.1 R65.1 U4.2(GND) U4.3(SDOWN) U4.9(GND) U10.11(P:V-) VR1.1 VR1.1P ; also sheet 1,2,3,5
HEADPHONE_OUT_L [DATA]: C62.-(NEG) ; also sheet 1
HEADPHONE_OUT_R [DATA]: C63.-(NEG) ; also sheet 1
HEADPHONE_WIPER_L [DATA]: C53.1 R7.2 VR1.2P
HEADPHONE_WIPER_R [DATA]: C54.1 R20.2 VR1.2
N$12 [DATA]: C54.2 R24.2
N$18: C19.2 R32.1 R38.2 U10.3(A:+IN)
N$19 [DATA]: R23.1 R27.2 U4.8(IN1)
N$20 [DATA]: R24.1 R33.2 U4.4(IN2)
N$24: R69.2 U10.1(A:OUT) U10.2(A:-IN)
N$30: C21.2 R44.1 R46.2 U10.5(B:+IN)
N$33: R71.2 U10.6(B:-IN) U10.7(B:OUT)
N$34 [DATA]: C53.2 R23.2
N$36: C24.2 R48.1 U10.10(C:+IN)
N$38: C25.2 R62.1 U10.12(D:+IN)
N$39 [DATA]: C56.2 U4.1(BPASS)
N$40 [DATA]: C62.+(POS) R27.1 U4.7(OUT1)
N$41 [DATA]: C63.+(POS) R33.1 U4.5(OUT2)
N$43: C20.1 R69.1
N$48: C22.1 R71.1
OUT_L_ATTEN: R5.1 R7.1 ; also sheet 1
OUT_R_ATTEN: R13.1 R20.1 ; also sheet 1
V_AUDIOBIAS: R48.2 R62.2 ; also sheet 2

### Notes on the sheet
- Audio
- Buffers the output signal
  
  Biased at 2V5
- HEADPHONE VOLUME POT
- HEADPHONE AMPLIFIER
- Gain = 33K/22K = 1.5 V/V
- Input Buffer:
  
  2M Input Impedance, biased at 2V5
  
  Begins to saturate at 2V5pp

## Sheet 5 of 5
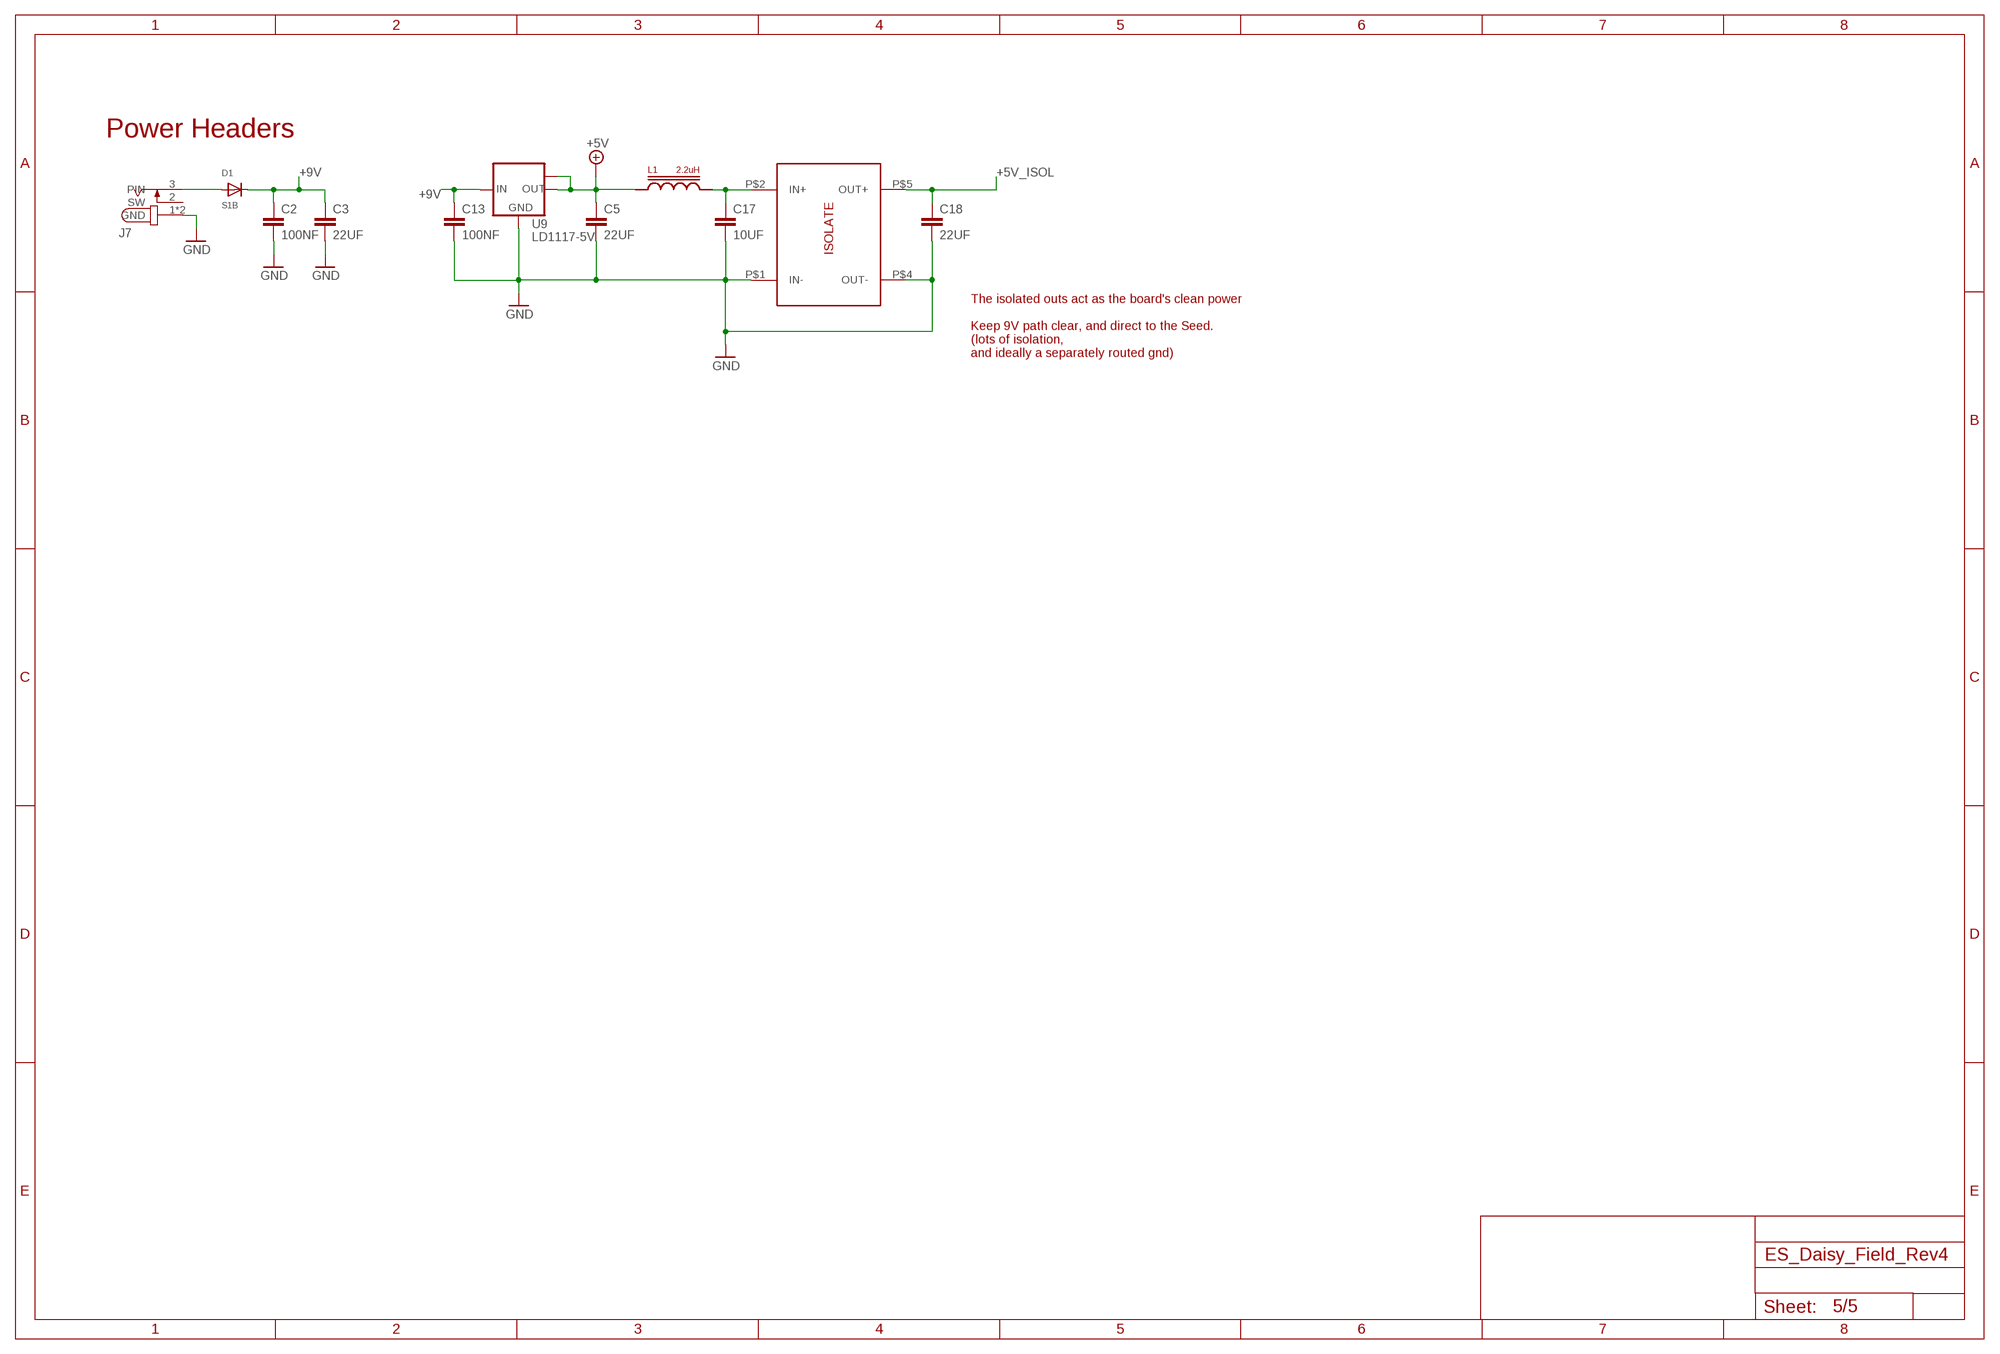
[diagram p4: schematic, sheet 5]

### Parts
C2  100NF  C-EUC0603  [C0603]
C3  22UF  C-EUC1206  [C1206]
C5  22UF  C-EUC0805  [C0805]
C13  100NF  C-EUC0603  [C0603]
C17  10UF  C-EUC0805  [C0805]
C18  22UF  C-EUC1206  [C1206]
D1  S1B  [SMADIODE]
J7  SMT GUITAR DC JACK  GUITAR_DC_JACK  [WQP-DC0500]
L1  2.2uH  INDUCTORS  [BOURNS_SRP2010]
U9  LD1117-5V  [SOT223]
U$4  POWER_ISOLATE  [XP_POWER_ISEXXXXA]

### Nets
+5V: C5.1 L1.P$1 U9.2(OUT) U9.TAB(OUT1) ; also sheet 2
+5V_ISOL: C18.1 U$4.P$5(OUT+) ; also sheet 2,4
+9V: C2.1 C3.1 C13.1 D1.C U9.3(IN) ; also sheet 1,3
GND: C2.2 C3.2 C5.2 C13.2 C17.2 C18.2 J7.1(GND) J7.4(GND) U9.1(GND) U$4.P$1(IN-) U$4.P$4(OUT-) ; also sheet 1,2,3,4
N$2: D1.A J7.3(PIN)
N$15: C17.1 L1.P$2 U$4.P$2(IN+)
Unconnected: J7.2(SW)

### Notes on the sheet
- Power Headers
- The isolated outs act as the board's clean power
  
  Keep 9V path clear, and direct to the Seed. 
  (lots of isolation, 
  and ideally a separately routed gnd)

## Library data of the parts
C1 C2 C4 C6-C15 C23 C53 C54 C56 C60 = Electrosmith-Passives:C-EU: CAPACITOR, European symbol; PACKAGE: C0603
C3 C16 C18 = Electrosmith-Passives:C-EU: CAPACITOR, European symbol; PACKAGE: C1206
C5 C17 C19-C22 C24 C25 C59 = Electrosmith-Passives:C-EU: CAPACITOR, European symbol; PACKAGE: C0805
C62 C63 = Electrosmith-Passives:C-EU-POL
D1 = Electrosmith-Semiconductors:S1B; BIN#: 12-006; IPN: S1B; MPN: S1B; PACKAGE: SMA
D5 = Electrosmith-Semiconductors:DIODE: Diode SMADIODE - SMA Surface Mount Package 20V 1A Schottky Diode Digikey: 641-1014-6-ND DO-1N4148 - Through Hole Small Current Diode SOD-123 20V 1 A (.5mV Vf) Schottky Diode - Digikey: MBRX120TPMSCT-ND SOD-323 10V 570mA (.38mV Vf, 3ns) Schottky Diode - Digikey: ZLLS410CT-ND SOD-523 30V 30mA Schottky Diode (RB751S-40TE61) - Digikey: RB751S-40TE61CT-ND SOT23-R/W - SOT23 Package (R = Solder Paste/Reflow Ovens, W = Hand-Soldering) BAT54Film 40V 300mA - Digikey: 497-7162-1-ND; PACKAGE: SOD-323
FB4 = Electrosmith-Passives:FERRITE_BEAD: SMD EMI Suppression Ferrite Beads - excellent anti-EMI properties - low DCR - impedances till 3000 ohms - rated current up to 6 A; BIN#: 8-047; IPN: FB R0603; MPN: MI0603J601R-10; PACKAGE: R0603
FD1-FD6 = Electrosmith-Connectors:FIDUCIAL: For use by pick and place machines to calibrate the vision/machine, 1mm By microbuilder.eu
H1-H3 = Electrosmith-Connectors:MOUNT-PAD-ROUND: MOUNTING PAD, round
J7 = Electrosmith-Connectors:GUITAR_DC_JACK
J8-J10 J12 J13 = Electrosmith-Interface:JACK_TRS_SWITCHING
J_CV_1-J_CV_4 J_CV_OUT_1 J_CV_OUT_2 J_GATE_IN_1 J_GATE_OUT = Electrosmith-Interface:EURO_JACK
J_MIDI_IN J_MIDI_OUT = Electrosmith-Interface:STEREO_JACK
L1 L4 = Electrosmith-Passives:INDUCTOR
LED_KNOBG1-LED_KNOBG8 = Electrosmith-Interface:LED; COLOR: YELLOW; MPN: APT1608LSYCK/J3-PRV
P1 P2 = Electrosmith-Connectors:M08X2?; LABEL: solder on this side
Q1 = Electrosmith-Semiconductors:NPN: NPN Transistror BF959 corrected 2008.03.06
R1-R38 R40-R44 R46-R73 R78 R79 R83 R84 R87 R88 = Electrosmith-Passives:R-US_: RESISTOR, American symbol; PACKAGE: R0603
S1 S2 = Electrosmith-Interface:TAC_SWITCH_SMT: Momentary Switch Button commonly used for reset or general input. Spark Fun Electronics SKU : COM-00097; BIN#: 24-010; IPN: SMT Mini Button; MPN: TL3301SPF160QJ
U1 = Electrosmith-Boards:ES_DAISY_SEED_REV4
U2 = Electrosmith-Interface:MICRO_SD_CARD
U3 U6 = Electrosmith-IC:MCP6004; BIN#: N/A; IPN: MCP6004 TSSOP-14; MPN: MCP6004T-E/ST; PACKAGE: TSSOP-14
U4 = Electrosmith-IC:TPA6110
U5 = Electrosmith-IC:PCA9685; BIN#: 16-016; IPN: PCA9685 TSSOP-28; MPN: PCA9685PW,118; PACKAGE: TSSOP-28
U7 = Electrosmith-IC:TPS6217N; MPN: TPS62170
U8 = Electrosmith-Interface:OLED_DISPLAY; IPN: 1.5" Display Module PTH; MPN: ER-OLEDM015-2W-SPI-I2C
U9 = Electrosmith-Power:LD1117; BIN#: 12-025; IPN: LD1117-5V; MPN: LD1117S50CTR; PACKAGE: SOT-223
U10 = Electrosmith-IC:OPA1654: OP AMP
U11 = Electrosmith-IC:4051: 8-channel ANALOG MULTIPLEXER
U15 = Electrosmith-IC:OPTOISOLATOR_H11L1M; MPN: H11L1SR2M
U16 = Electrosmith-Boards:ES_KEYBOARD_SM
U$4 = Electrosmith-IC:POWER_ISOLATE; MPN: ISE2405A
VR1 = Electrosmith-Interface:POT_DUAL_GANG
VR_1-VR_7 = Electrosmith-Interface:POT_9MM_SNAP-IN_: 9mm vertical snap-in pot, Alpha / Panasonic style
VR_8 = Electrosmith-Interface:POT_9MM_CHASSIS: 9mm vertical snap-in pot, Alpha / Panasonic style

## Net classes
0 DEFAULT: width 0.102 mm, drill 0.2 mm, clearance 0.102 mm
1 POWER: width 0.102 mm, drill 0.2 mm, clearance 0.102 mm